# Altium schematic sheet Supply_Stabilizer.SchDoc: Stabilizer (part 1 of 2)
size 420 x 297 mm; EDA_Number: ARTIQ; Projet: Stabilizer; Author: G.Kasprowicz; CompanyName: WUT ISE; DrawnBy: G.Kasprowicz; Organization: WUT ISE; Address1: PW ISE; Address2: Nowowiejska 15/19 00-665 Warsaw; Address3: gkasprow@gmail.com; DocumentNumber: 2; Revision: 3.4; SheetNumber: 2; SheetTotal: 11; ModifiedBy: -; CheckedDate: -; Title2: Power supply; DivGrp: WUT ISE; Designer: G.Kasprowicz; ModifiedDate: -; ProjectName: Sensor Box
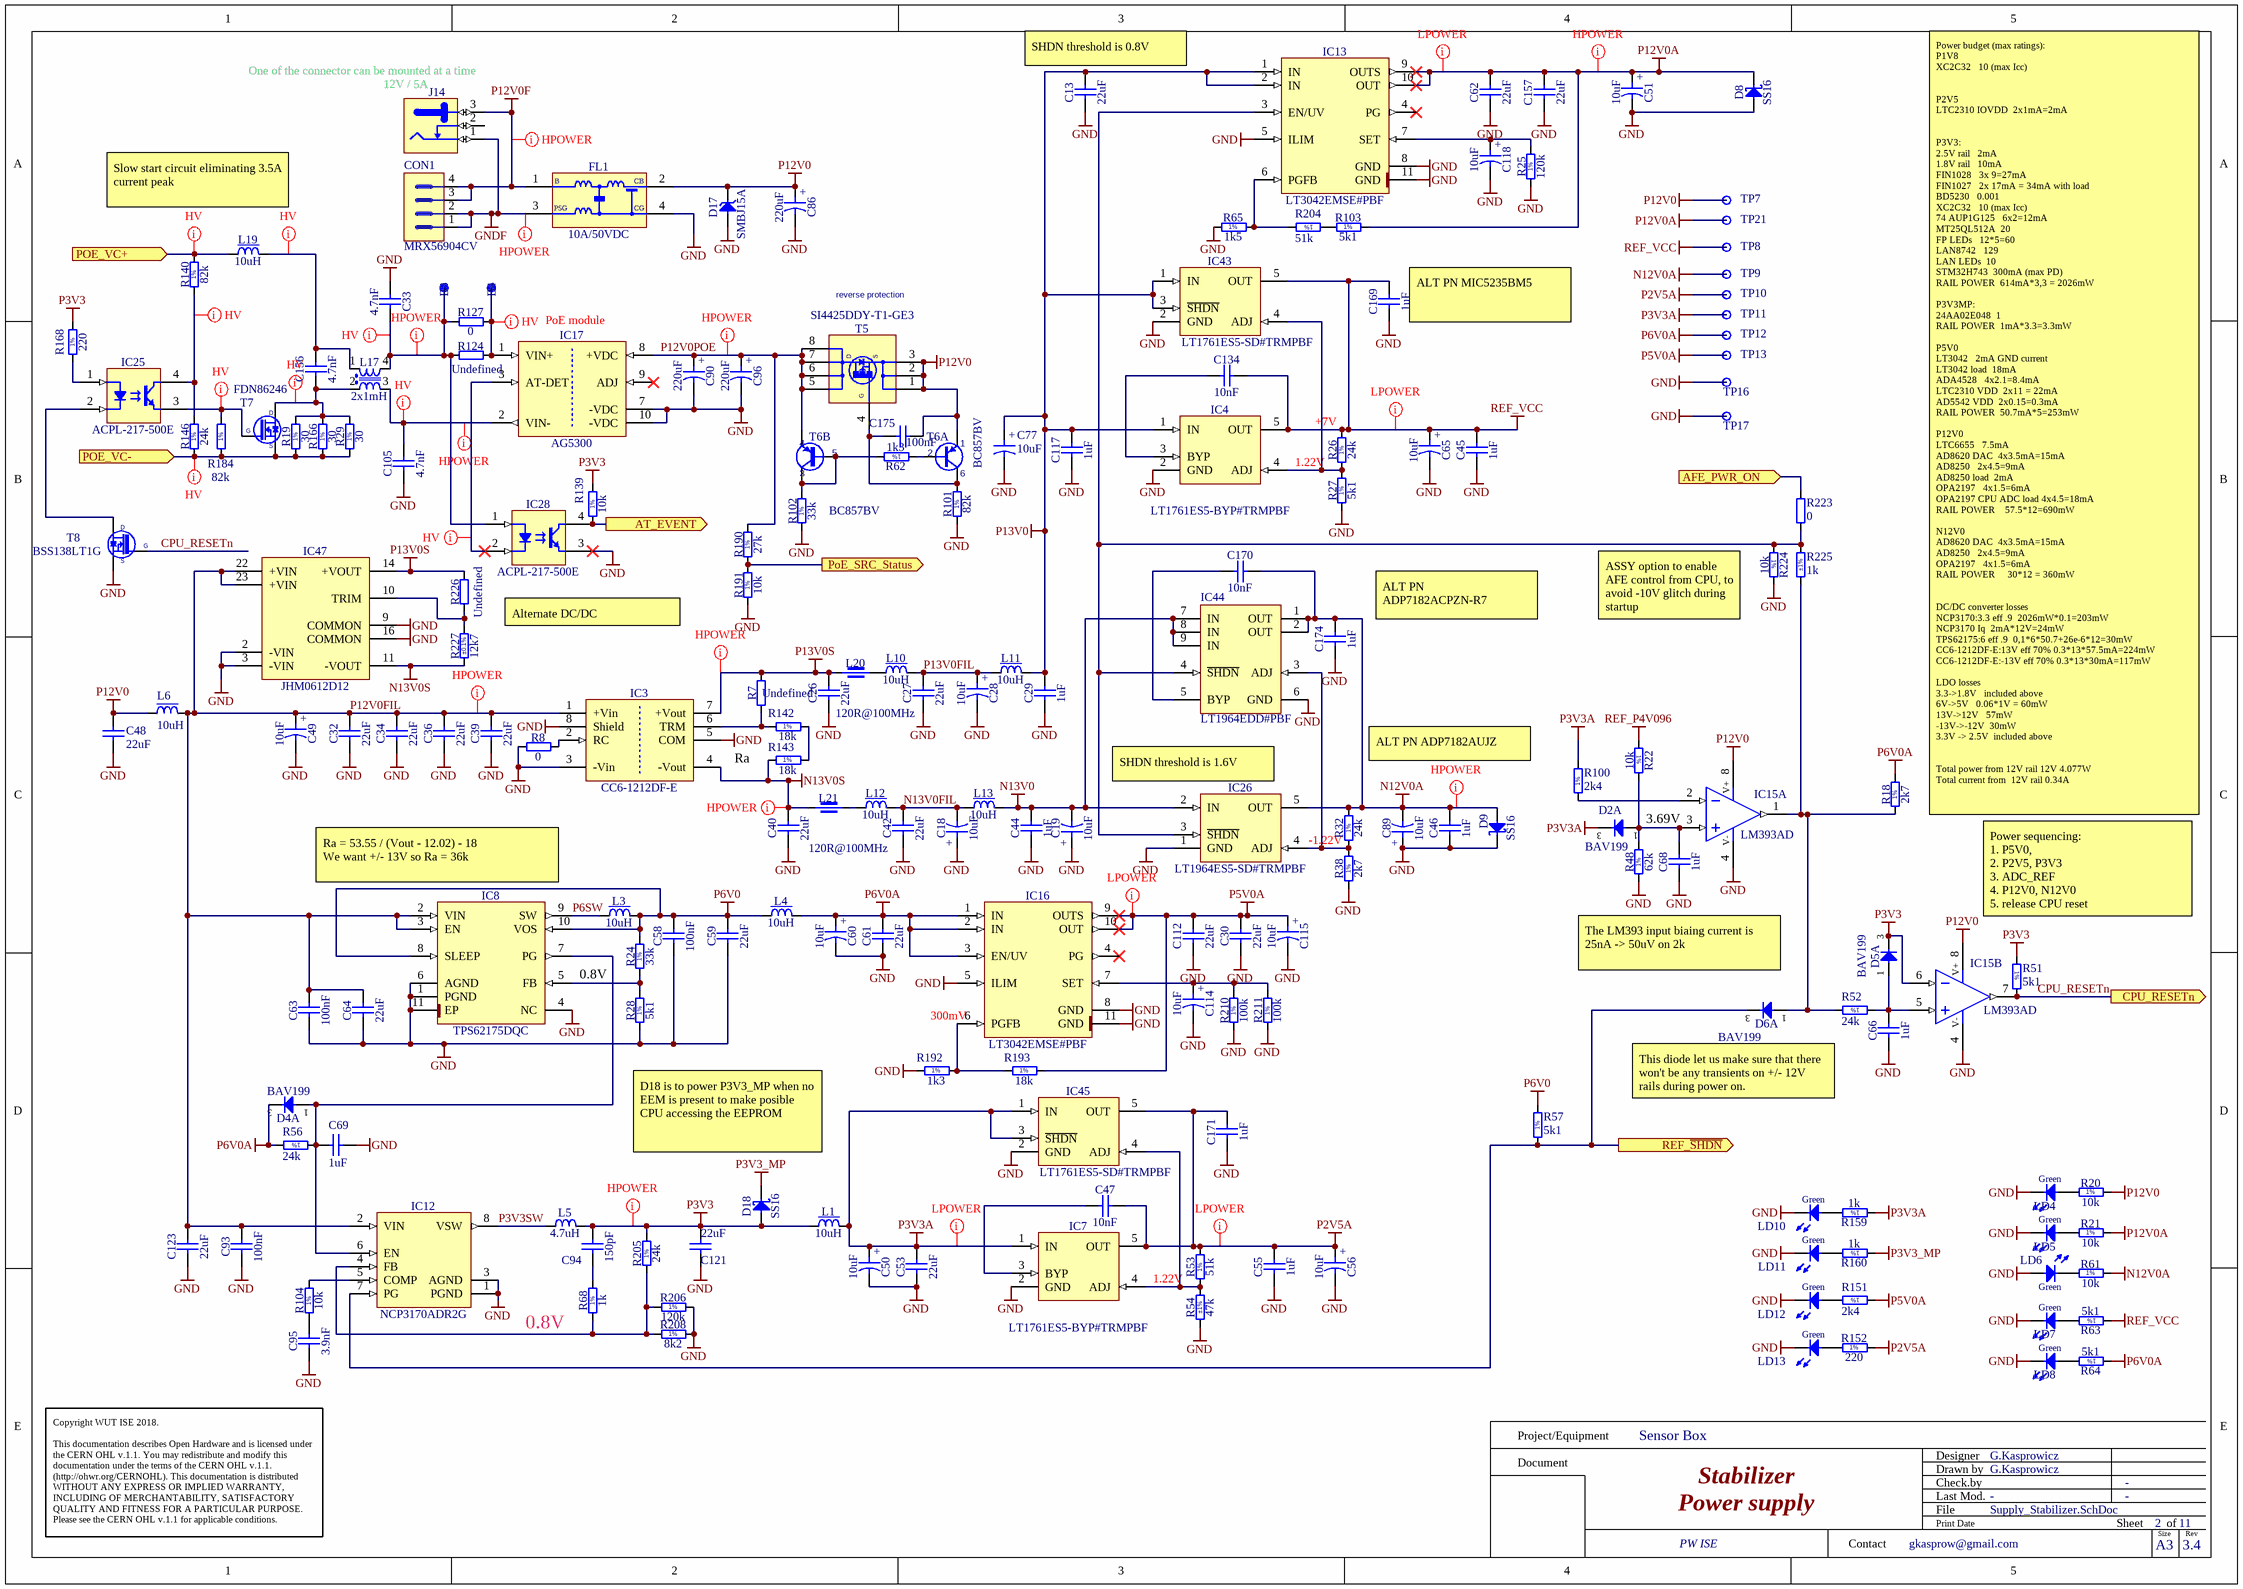
[diagram p0: Supply_Stabilizer.SchDoc]

## Parts
B3  SMD Pad  [C100]  (value not drawn)
B4  SMD Pad  [C100]  (value not drawn)
C13  22uF  [CAPC2012X135N]
C18  10uF  [CAPMP3216X180N]
C19  10uF  [CAPMP3216X180N]
C26  22uF  [CAPC2012X135N]
C27  22uF  [CAPC2012X135N]
C28  10uF  [CAPMP3216X180N]
C29  1uF  [CAPC1608X87N]
C30  22uF  [CAPC2012X135N]
C32  22uF  [CAPC2012X135N]
C33  4.7nF  [CAPC3216X140N]
C34  22uF  [CAPC2012X135N]
C36  22uF  [CAPC2012X135N]
C39  22uF  [CAPC2012X135N]
C40  22uF  [CAPC2012X135N]
C42  22uF  [CAPC2012X135N]
C44  1uF  [CAPC1608X87N]
C45  1uF  [CAPC1608X87N]
C46  1uF  [CAPC1608X87N]
C47  10nF  [CAPC1608X87N]
C48  22uF  [CAPC2012X135N]
C49  10uF  [CAPMP3216X180N]
C50  10uF  [CAPMP3216X180N]
C51  10uF  [CAPMP3216X180N]
C53  22uF  [CAPC2012X135N]
C55  1uF  [CAPC1608X87N]
C56  10uF  [CAPMP3216X180N]
C58  100nF  [CAPC1005X55N]
C59  22uF  [CAPC2012X135N]
C60  10uF  [CAPMP3216X180N]
C61  22uF  [CAPC2012X135N]
C62  22uF  [CAPC2012X135N]
C63  100nF  [CAPC1005X55N]
C64  22uF  [CAPC2012X135N]
C65  10uF  [CAPMP3216X180N]
C66  1uF  [CAPC1608X87N]
C68  1uF  [CAPC1608X87N]
C69  1uF  [CAPC1608X87N]
C77  10uF  [CAPMP3216X180N]
C86  220uF  [CAPAE830X620N]
C89  10uF  [CAPMP3216X180N]
C90  220uF  [CAPAE830X620N]
C93  100nF  [CAPC1005X55N]
C94  150pF  [CAPC1608X87N]
C95  3.9nF  [CAPC1608X87N]
C96  220uF  [CAPAE830X620N]
C105  4.7nF  [CAPC3216X140N]
C112  22uF  [CAPC2012X135N]
C114  10uF  [CAPMP3216X180N]
C115  10uF  [CAPMP3216X180N]
C117  1uF  [CAPC1608X87N]
C118  10uF  [CAPMP3216X180N]
C121  22uF  [CAPC2012X135N]
C123  22uF  [CAPC2012X135N]
C134  10nF  [CAPC1608X87N]
C156  4.7nF  [CAPC3216X140N]
C157  22uF  [CAPC2012X135N]
C169  1uF  [CAPC1608X87N]
C170  10nF  [CAPC1608X87N]
C171  1uF  [CAPC1608X87N]
C174  1uF  [CAPC1608X87N]
C175  100nF  [CAPC1608X87N]
CON1  MRX56904CV  [MRX56904CV]
D2  BAV199  [SOT95P240X110-3N]  (part A of 2)
D4  BAV199  [SOT95P240X110-3N]  (part A of 2)
D5  BAV199  [SOT95P240X110-3N]  (part A of 2)
D6  BAV199  [SOT95P240X110-3N]  (part A of 2)
D8  SS16  [DIOM5127X229N]
D9  SS16  [DIOM5127X229N]
D17  SMBJ15A  [DIOM5336X265N]
D18  SS16  [DIOM5127X229N]
FL1  10A/50VDC  [FIL_MURATA_BNX02]
IC3  CC6-1212DF-E  [CC6-1212DF-E]
IC4  LT1761ES5-BYP#TRMPBF  [SOT95P280X100-5N]
IC7  LT1761ES5-BYP#TRMPBF  [SOT95P280X100-5N]
IC8  TPS62175DQC  [SON50P200X300X80-11N-R94X250]
IC12  NCP3170ADR2G  [SOIC127P600X175-8N]
IC13  LT3042EMSE#PBF  [SOP50P490X110-11N-R168X198]
IC15  LM393AD  [SOIC127P600X175-8N]  (parts A,B of 2)
IC16  LT3042EMSE#PBF  [SOP50P490X110-11N-R168X198]
IC17  AG5300  [SILVERTEL_AG5300]
IC25  ACPL-217-500E  [SOIC127P700X242-4N]
IC26  LT1964ES5-SD#TRMPBF  [SOT95P280X100-5N]
IC28  ACPL-217-500E  [SOIC127P700X242-4N]
IC43  LT1761ES5-SD#TRMPBF  [SOT95P280X100-5N]
IC44  LT1964EDD#PBF  [LT-DD-8_V]
IC45  LT1761ES5-SD#TRMPBF  [SOT95P280X100-5N]
IC47  JHM0612D12  [DCDC_XPPOWER_JHM0X]
J14  Jack  [SWITCHCRAFT_L712RA]  (value not drawn)
L1  10uH  [IND_MURATA-PS_8400]
L3  10uH  [IND_MURATA-PS_8400]
L4  10uH  [IND_MURATA-PS_8400]
L5  4.7uH  [IND_BOURNS_SRU8043]
L6  10uH  [IND_MURATA-PS_8400]
L10  10uH  [IND_MURATA-PS_8400]
L11  10uH  [IND_MURATA-PS_8400]
L12  10uH  [IND_MURATA-PS_8400]
L13  10uH  [IND_MURATA-PS_8400]
L17  2x1mH  [IND_WURTH_WE-SL2]
L19  10uH  [IND_MURATA-PS_8400]
L20  120R@100MHz  [INDC1608X95N]
L21  120R@100MHz  [INDC1608X95N]
LD4  Green  [LED_KINGBRIGHT_KPH-1608CGCK]
LD5  Green  [LED_KINGBRIGHT_KPH-1608CGCK]
LD6  Green  [LED_KINGBRIGHT_KPH-1608CGCK]
LD7  Green  [LED_KINGBRIGHT_KPH-1608CGCK]
LD8  Green  [LED_KINGBRIGHT_KPH-1608CGCK]
LD10  Green  [LED_KINGBRIGHT_KPH-1608CGCK]
LD11  Green  [LED_KINGBRIGHT_KPH-1608CGCK]
LD12  Green  [LED_KINGBRIGHT_KPH-1608CGCK]
LD13  Green  [LED_KINGBRIGHT_KPH-1608CGCK]
R7  Undefined  [RESC1608X55N]
R8  0  [RESC1005X40N]
R18  2k7  [RESC1608X55N]
R19  30  [RESC1608X55N]
R20  10k  [RESC1005X40N]
R21  10k  [RESC1005X40N]
R22  10k  [RESC1005X40N]
R24  33k  [RESC1005X40N]
R25  120k  [RESC1608X55N]
R26  24k  [RESC1608X55N]
R27  5k1  [RESC1005X40N]
R28  5k1  [RESC1005X40N]
R29  30  [RESC1608X55N]
R32  24k  [RESC1608X55N]
R38  2k7  [RESC1608X55N]
R48  62k  [RESC1005X40N]
R51  5k1  [RESC1005X40N]
R52  24k  [RESC1608X55N]
R53  51k  [RESC1005X40N]
R54  47k  Tolerance: ±1%  [RESC1005X40N]
R56  24k  [RESC1608X55N]
R57  5k1  [RESC1005X40N]
R61  10k  [RESC1005X40N]
R62  1k3  [RESC1608X55N]
R63  5k1  [RESC1005X40N]
R64  5k1  [RESC1005X40N]
R65  1k5  [RESC1005X40N]
R68  1k  [RESC1608X55N]
R100  2k4  [RESC1005X40N]
R101  82k  [RESC1608X55N]
R102  33k  [RESC1005X40N]
R103  5k1  [RESC1005X40N]
R104  10k  [RESC1005X40N]
R124  Undefined  [RESC2012X60N]
R127  0  [RESC1005X40N]
R139  10k  [RESC1005X40N]
R140  82k  [RESC1608X55N]
R142  18k  [RESC1005X40N]
R143  18k  [RESC1005X40N]
R146  24k  [RESC1608X55N]
R151  2k4  [RESC1005X40N]
R152  220  [RESC1608X55N]
R159  1k  [RESC1608X55N]
R160  1k  [RESC1608X55N]
R166  30  [RESC1608X55N]
R168  220  [RESC1608X55N]
R184  82k  [RESC1608X55N]
R190  27k  [RESC1005X40N]
R191  10k  [RESC1005X40N]
R192  1k3  [RESC1608X55N]
R193  18k  [RESC1005X40N]
R204  51k  [RESC1005X40N]
R205  24k  [RESC1608X55N]
R206  120k  [RESC1608X55N]
R208  8k2  [RESC1005X40N]
R210  100k  [RESC1608X55N]
R211  100k  [RESC1608X55N]
R223  0  [RESC1005X40N]
R224  10k  [RESC1005X40N]
R225  1k  Tolerance: ±1%  [RESC1608X55N]
R226  Undefined  [RESC1608X55N]
R227  12k7  Tolerance: ±0.1%  [RESC1608X55N]
T5  SI4425DDY-T1-GE3  [SOIC127P600X175-8N]
T6  BC857BV  [SOTFL50P160X60-6N]  (parts A,B of 2)
T7  FDN86246  [SOT95P237X112-3N]
T8  BSS138LT1G  [SOT95P240X110-3N]
TP7  Test Point  [TPS127]  (value not drawn)
TP8  Test Point  [TPS127]  (value not drawn)
TP9  Test Point  [TPS127]  (value not drawn)
TP10  Test Point  [TPS127]  (value not drawn)
TP11  Test Point  [TPS127]  (value not drawn)
TP12  Test Point  [TPS127]  (value not drawn)
TP13  Test Point  [TPS127]  (value not drawn)
TP16  Test Point  [TPS127]  (value not drawn)
TP17  Test Point  [TPS127]  (value not drawn)
TP21  Test Point  [TPS127]  (value not drawn)

## Ports
AFE_PWR_ON (in), AT_EVENT (out), CPU_RESETn (out), PoE_SRC_Status (out), POE_VC+ (in), POE_VC- (in), REF_~{SHDN} (out)

## Nets
GND: C13.1 C18.1 C19.1 C26.1 C27.1 C28.2 C29.1 C30.1 C32.1 C33.1 C34.1 C36.1 C39.1 C40.1 C42.1 C44.1 C45.1 C46.1 C48.1 C49.2 C50.2 C51.2 C53.1 C55.1 C56.2 C58.1 C59.1 C60.2 C61.1 C62.1 C63.1 C64.1 C65.2 C66.1 C68.1 C69.1 C77.2 C86.2 C89.1 C90.2 C93.1 C95.1 C96.2 C105.1 C112.1 C114.2 C115.2 C117.1 C118.2 C121.1 C123.1 C157.1 C169.1 C171.1 C174.1 D8.2(A) D9.1(C) D17.2(A) FL1.4(CG) IC3.3(-Vin) IC3.5(COM) IC3.8(Shield) IC4.2(GND) IC7.2(GND) IC8.1(PGND) IC8.4(NC) IC8.6(AGND) IC8.11(EP) IC12.1(PGND) IC12.3(AGND) IC13.5(ILIM) IC13.8(GND) IC13.11(GND) IC15.4(V-) IC16.5(ILIM) IC16.8(GND) IC16.11(GND) IC17.7(-VDC) IC17.10(-VDC) IC26.1(GND) IC28.3(E) IC43.2(GND) IC44.6(GND) IC45.2(GND) IC47.2(-VIN) IC47.3(-VIN) IC47.9(COMMON) IC47.16(COMMON) LD4.1(C) LD5.1(C) LD6.2(A) LD7.1(C) LD8.1(C) LD10.1(C) LD11.1(C) LD12.1(C) LD13.1(C) R8.1 R25.1 R27.1 R28.1 R38.1 R48.1 R54.1 R65.1 R101.1 R102.1 R191.1 R192.1 R206.2 R208.2 R210.1 R211.1 R224.2 T8.2(S) TP16.1 TP17.1
GNDF: CON1.1 CON1.2 FL1.3(PSG) J14.1
N12V0A: C46.2 C89.2 C170.2 C174.2 D9.2(A) IC26.5(OUT) IC44.1(OUT) IC44.2(OUT) R32.2 R61.2 TP9.1
N13V0: C19.2 C44.2 IC26.2(IN) IC44.7(IN) IC44.8(IN) IC44.9(IN) L13.2
N13V0S: C40.2 IC3.4(-Vout) IC47.11(-VOUT) L21.1 R143.1 R227.1
P2V5A: C47.2 C55.2 C56.1 C171.2 IC7.5(OUT) IC45.5(OUT) R53.2 R152.2 TP10.1
P3V3: C94.2 C121.2 D5.3(COMAC) D18.2(A) IC15.6(IN-) L1.1 L5.2 R51.1 R139.2 R168.2 R205.2
P3V3_MP: D18.1(C) R160.1
P3V3A: C50.1 C53.2 D2.3(COMAC) IC7.1(IN) IC45.1(IN) IC45.3(~{SHDN}) L1.2 R100.2 R159.1 TP11.1
P5V0A: C30.2 C112.2 C115.1 IC16.9(OUTS) IC16.10(OUT) R151.1 R193.2 TP13.1
P6V0: C58.2 C59.2 IC8.8(SLEEP) IC8.10(VOS) L3.2 L4.1 R24.2 R57.2
P6V0A: C60.1 C61.2 D4.3(COMAC) IC16.1(IN) IC16.2(IN) IC16.3(EN/UV) L4.2 R18.2 R56.2 R64.1 TP12.1
P12V0: C48.2 C86.1 C175.2 D17.1(C) FL1.2(CB) IC15.8(V+) L6.1 R20.2 T5.1(S) T5.2(S) T5.3(S) T6.1(E) TP7.1
P12V0A: C51.1 C62.2 C157.2 D8.1(C) IC13.9(OUTS) IC13.10(OUT) R21.2 R103.2 TP21.1
P12V0F: CON1.3 CON1.4 FL1.1(B) J14.3
P13V0: C13.2 C29.2 C77.1 C117.2 IC4.1(IN) IC13.1(IN) IC13.2(IN) IC43.1(IN) IC43.3(~{SHDN}) L11.2
P13V0S: C26.2 IC3.7(+Vout) IC47.14(+VOUT) L20.1 R7.2 R226.2
REF_P4V096: R22.1
REF_VCC: C45.2 C65.1 C134.2 C169.2 IC4.5(OUT) IC43.5(OUT) R26.2 R63.1 TP8.1
AFE_PWR_ON: R223.1 ; port AFE_PWR_ON
AT_EVENT: IC28.4(C) R139.1 ; port AT_EVENT
CPU_RESETn: IC15.7(OUT) R51.2 T8.1(G) ; port CPU_RESETn
N13V0FIL: C18.2 C42.2 L12.2 L13.1
P3V3SW: IC12.8(VSW) L5.1
P6SW: IC8.9(SW) L3.1
P12V0FIL: C32.2 C34.2 C36.2 C39.2 C49.1 C63.2 C64.2 C93.2 C123.2 IC3.1(+Vin) IC8.2(VIN) IC8.3(EN) IC12.2(VIN) IC47.22(+VIN) IC47.23(+VIN) L6.2
P12V0POE: C90.1 C96.1 IC17.8(+VDC) R190.2 T5.5(D) T5.6(D) T5.7(D) T5.8(D) T6.4(E)
P13V0FIL: C27.2 C28.1 L10.2 L11.1
PoE_SRC_Status: R190.1 R191.2 ; port PoE_SRC_Status
POE_VC+: L19.1 R140.2 ; port POE_VC+
POE_VC-: R19.1 R29.1 R146.1 R166.1 R184.1 T7.2(S) ; port POE_VC-
REF_~{SHDN}: D6.3(COMAC) IC12.7(PG) R57.1 ; port REF_~{SHDN}
NetB3_1: B3.1 C33.2 IC28.1(A) L17.4 R124.1 R127.1
NetB4_1: B4.1 IC17.1(VIN+) R124.2 R127.2
NetC47_1: C47.1 IC7.3(BYP)
NetC66_2: C66.2 D5.1(A) IC15.5(IN+) R52.1
NetC68_2: C68.2 D2.1(A) IC15.3(IN+) R22.2 R48.2
NetC69_2: C69.2 D4.1(A) IC8.7(PG) IC12.6(EN) R56.1
NetC94_1: C94.1 R68.2
NetC95_2: C95.2 R104.1
NetC105_2: C105.2 IC17.2(VIN-) L17.3
NetC114_1: C114.1 IC16.7(SET) R210.2 R211.2
NetC118_1: C118.1 IC13.7(SET) R25.2
NetC134_1: C134.1 IC4.3(BYP)
NetC156_1: C156.1 L17.2 R19.2 R29.2 R166.2 T7.3(D)
NetC156_2: C156.2 L17.1 L19.2
NetC170_1: C170.1 IC44.5(BYP)
NetC175_1: C175.1 R101.2 T5.4(S) T6.6(C)
NetD6_1: D6.1(A) IC15.1(OUT) R18.1 R52.2 R225.1
NetIC3_2: IC3.2(RC) R8.2
NetIC3_6: IC3.6(TRM) R7.1 R142.1
NetIC4_4: IC4.4(ADJ) IC43.4(ADJ) R26.1 R27.2
NetIC7_4: IC7.4(ADJ) IC45.4(ADJ) R53.1 R54.2
NetIC8_5: IC8.5(FB) R24.1 R28.2
NetIC12_4: IC12.4(FB) R68.1 R205.1 R206.1 R208.1
NetIC12_5: IC12.5(COMP) R104.2
NetIC13_3: IC13.3(EN/UV) IC26.3(~{SHDN}) IC44.4(~{SHDN}) R223.2 R224.1 R225.2
NetIC13_6: IC13.6(PGFB) R65.2 R204.2
NetIC15_2: IC15.2(IN-) R100.1
NetIC16_6: IC16.6(PGFB) R192.2 R193.1
NetIC17_3: IC17.3(AT-DET) IC28.2(C)
NetIC25_1: IC25.1(A) R168.1
NetIC25_2: IC25.2(C) T8.3(D)
NetIC25_3: IC25.3(E) R184.2 T7.1(G)
NetIC25_4: IC25.4(C) R140.1 R146.2
NetIC26_4: IC26.4(ADJ) IC44.3(ADJ) R32.1 R38.2
NetIC47_10: IC47.10(TRIM) R226.1 R227.2
NetL10_1: L10.1 L20.2
NetL12_1: L12.1 L21.2
NetLD4_2: LD4.2(A) R20.1
NetLD5_2: LD5.2(A) R21.1
NetLD6_1: LD6.1(C) R61.1
NetLD7_2: LD7.2(A) R63.2
NetLD8_2: LD8.2(A) R64.2
NetLD10_2: LD10.2(A) R159.2
NetLD11_2: LD11.2(A) R160.2
NetLD12_2: LD12.2(A) R151.2
NetLD13_2: LD13.2(A) R152.1
NetR62_1: R62.1 T6.2(B)
NetR62_2: R62.2 R102.2 T6.3(C) T6.5(B)
NetR103_1: R103.1 R204.1
NetR142_2: R142.2 R143.2

Not connected (* = marked no-connect by the designer): IC13 4(PG)*; IC16 4(PG)*; IC17 9(ADJ)*; J14 2

## Layout directives
net class Hpower; rule Routing Via Style [Pref Size = 0.7mm    Pref Hole Size = 0.5mm]; rule Width Constraint [Pref Width = 20mil    Min Width = 15mil    Max Width = 50mil]: GNDF, N12V0A, N13V0S, NetB3_1, NetC105_2, P3V3, P12V0A, P12V0F, P12V0FIL, P12V0POE, P13V0S
net class Lpower; rule Routing Via Style [Pref Size = 0.6mm    Pref Hole Size = 0.3mm]; rule Width Constraint [Pref Width = 15mil    Min Width = 10mil    Max Width = 20mil]: P2V5A, P3V3A, P5V0A, P12V0A, REF_VCC
net class HV: NetB3_1, NetB4_1, NetC105_2, NetC156_1, NetC156_2, NetIC17_3, NetIC25_3, NetIC25_4, POE_VC+, POE_VC-

## Notes on the sheet
- (near J14) One of the connector can be mounted at a time
- (near J14) 12V / 5A
- (near C13) SHDN threshold is 0.8V
- Slow start circuit eliminating 3.5A current peak
- (near IC17) PoE module
- (near T5) reverse protection
- (near C169) ALT PN MIC5235BM5
- (near R26) +7V
- 1.22V
- Alternate DC/DC
  Trim +10%, R27=12.8k
- (near C174) ALT PN ADP7182ACPZN-R7
- (near R224) ASSY option to enable AFE control from CPU, to avoid -10V glitch during startup
- Ra
- (near IC26) SHDN threshold is 1.6V
- ALT PN ADP7182AUJZ
- -1.22V
- 3.69V
- (near R18) Power budget (max ratings):
  P1V8
  XC2C32			10 (max Icc)
  P2V5
  LTC2310	IOVDD		2x1mA=2mA
  P3V3:
  2.5V rail			2mA
  1.8V rail			10mA
  FIN1028			3x 9=27mA
  FIN1027			2x 17mA = 34mA with load
  BD5230			0.001
  XC2C32			10 (max Icc)
  74 AUP1G125 		6x2=12mA
  MT25QL512A		20
  FP LEDs			12*5=60
  LAN8742			129
  LAN LEDs		10
  STM32H743		300mA (max PD)
  RAIL POWER		614mA*3,3 = 2026mW
  P3V3MP:
  24AA02E048		1
  RAIL POWER		1mA*3.3=3.3mW
  P5V0
  LT3042			2mA GND current
  LT3042 load		18mA
  ADA4528			4x2.1=8.4mA
  LTC2310	VDD		2x11 = 22mA
  AD5542	VDD		2x0.15=0.3mA
  RAIL POWER		50.7mA*5=253mW
  P12V0
  LTC6655			7.5mA
  AD8620	DAC		4x3.5mA=15mA
  AD8250			2x4.5=9mA
  AD8250 load		2mA
  OPA2197			4x1.5=6mA
  OPA2197 CPU ADC load	4x4.5=18mA
  RAIL POWER 		 57.5*12=690mW
  N12V0
  AD8620	DAC		4x3.5mA=15mA
  AD8250			2x4.5=9mA
  OPA2197			4x1.5=6mA
  RAIL POWER  		 30*12 = 360mW
  DC/DC converter losses
  NCP3170:3.3 eff .9		2026mW*0.1=203mW
  NCP3170 Iq		2mA*12V=24mW
  TPS62175:6 eff .9		0,1*6*50.7+26e-6*12=30mW
  CC6-1212DF-E:13V eff 70%	0.3*13*57.5mA=224mW
  CC6-1212DF-E:-13V eff 70%	0.3*13*30mA=117mW
  LDO losses
  3.3->1.8V			included above
  6V->5V			0.06*1V = 60mW
  13V->12V			57mW
  -13V->-12V		30mW
  3.3V -> 2.5V		included above
  Total power from 12V rail	12V 4.077W
  Total current from  12V rail	0.34A
- (near IC8) Ra = 53.55 / (Vout - 12.02) - 18
  We want +/- 13V so Ra = 36k
- Power sequencing:
  1. P5V0,
  2. P2V5, P3V3
  3. ADC_REF
  4. P12V0, N12V0
  5. release CPU reset
- 0.8V
- The LM393 input biaing current is 25nA -> 50uV on 2k
- (near IC16) 300mV
- This diode let us make sure that there won't be any transients on +/- 12V rails during power on.
- D18 is to power P3V3_MP when no EEM is present to make posible CPU accessing the EEPROM
- (near R68) 0.8V
- Project/Equipment
- Document
- Designer
- Drawn by
- Check.by
- Copyright WUT ISE 2018.
  This documentation describes Open Hardware and is licensed under the CERN OHL v.1.1. You may redistribute and modify this documentation under the terms of the CERN OHL v.1.1. (http://ohwr.org/CERNOHL). This documentation is distributed WITHOUT ANY EXPRESS OR IMPLIED WARRANTY, INCLUDING OF MERCHANTABILITY, SATISFACTORY QUALITY AND FITNESS FOR A PARTICULAR PURPOSE. Please see the CERN OHL v.1.1 for applicable conditions.
- Contact
- File
- Last Mod.
- Print Date
- Sheet
- Size
- A3
- of
- Rev
- (in symbol CAE830-620_220UF_16V_20%) +
- (in symbol CTE3216-18_10UF_16V_20%_AVX_TCJ) +
- (in symbol R0402_1K5_1%_0.0625W_100PPM) 1%
- (in symbol R0402_2K4_1%_0.0625W_100PPM) 1%
- (in symbol R0402_5K1_1%_0.0625W_100PPM) 1%
- (in symbol R0402_8K2_1%_0.0625W_100PPM) 1%
- (in symbol R0402_10K_1%_0.0625W_100PPM) 1%
- (in symbol R0402_18K_1%_0.0625W_100PPM) 1%
- (in symbol R0402_27K_1%_0.0625W_100PPM) 1%
- (in symbol R0402_33K_1%_0.0625W_100PPM) 1%
- (in symbol R0402_51K_1%_0.0625W_100PPM) 1%
- (in symbol R0402_62K_1%_0.0625W_100PPM) 1%
- (in symbol R0603_1K3_1%_0.1W_100PPM) 1%
- (in symbol R0603_1K_1%_0.1W_100PPM) 1%
- (in symbol R0603_2K7_1%_0.1W_100PPM) 1%
- (in symbol R0603_24K_1%_0.1W_100PPM) 1%
- (in symbol R0603_30R_1%_0.1W_100PPM) 1%
- (in symbol R0603_82K_1%_0.1W_100PPM) 1%
- (in symbol R0603_100K_1%_0.1W_100PPM) 1%
- (in symbol R0603_120k_1%_0.1W_100PPM) 1%
- (in symbol R0603_220R_1%_0.1W_100PPM) 1%
- (in symbol SI4425DDY-T1-GE3) G